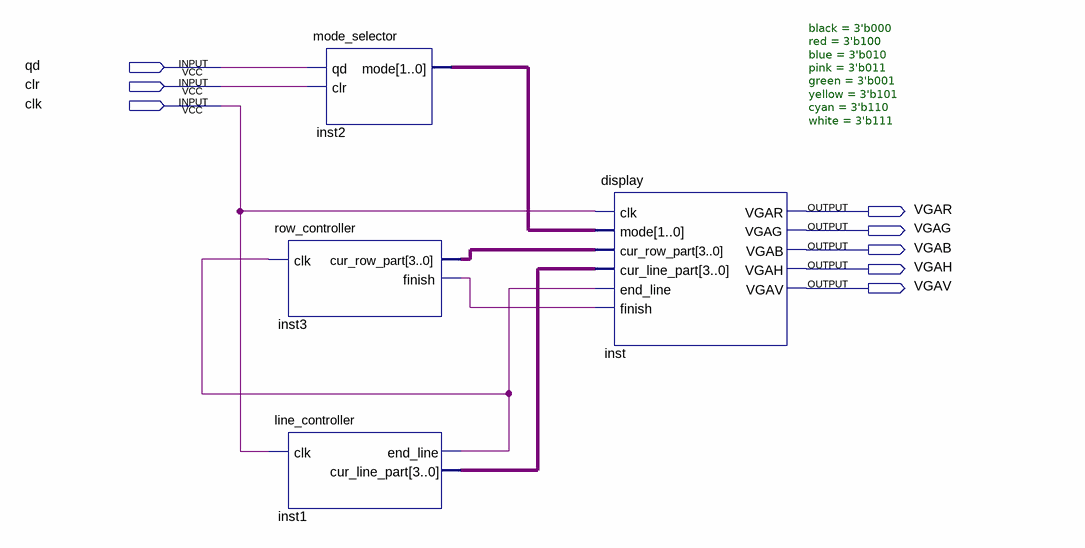
[diagram p0: schematic sheet]
// Quartus schematic vga_display.bdf as structural Verilog: 4 symbols, 8 pins
module vga_display (
  input  qd,
  input  clr,
  input  clk,
  output VGAR,
  output VGAG,
  output VGAB,
  output VGAH,
  output VGAV
);

  wire inst1_end_line, inst3_finish;
  wire [1:0] inst2_mode;
  wire [3:0] inst1_cur_line_part, inst3_cur_row_part;

  mode_selector inst2 (.qd(qd), .clr(clr), .mode(inst2_mode));
  row_controller inst3 (.clk(inst1_end_line), .cur_row_part(inst3_cur_row_part), .finish(inst3_finish));
  line_controller inst1 (.clk(clk), .end_line(inst1_end_line), .cur_line_part(inst1_cur_line_part));
  display #(.black(3'b000), .red(3'b100), .blue(3'b010), .pink(3'b011), .green(3'b001), .yellow(3'b101), .cyan(3'b110), .white(3'b111)) inst (
    .clk(clk), .mode(inst2_mode), .cur_row_part(inst3_cur_row_part), .cur_line_part(inst1_cur_line_part),
    .end_line(inst1_end_line), .finish(inst3_finish), .VGAR(VGAR), .VGAG(VGAG), .VGAB(VGAB), .VGAH(VGAH),
    .VGAV(VGAV));
endmodule
